# EAGLE schematic ESP-01 Miner (EAGLE 9.6.2)
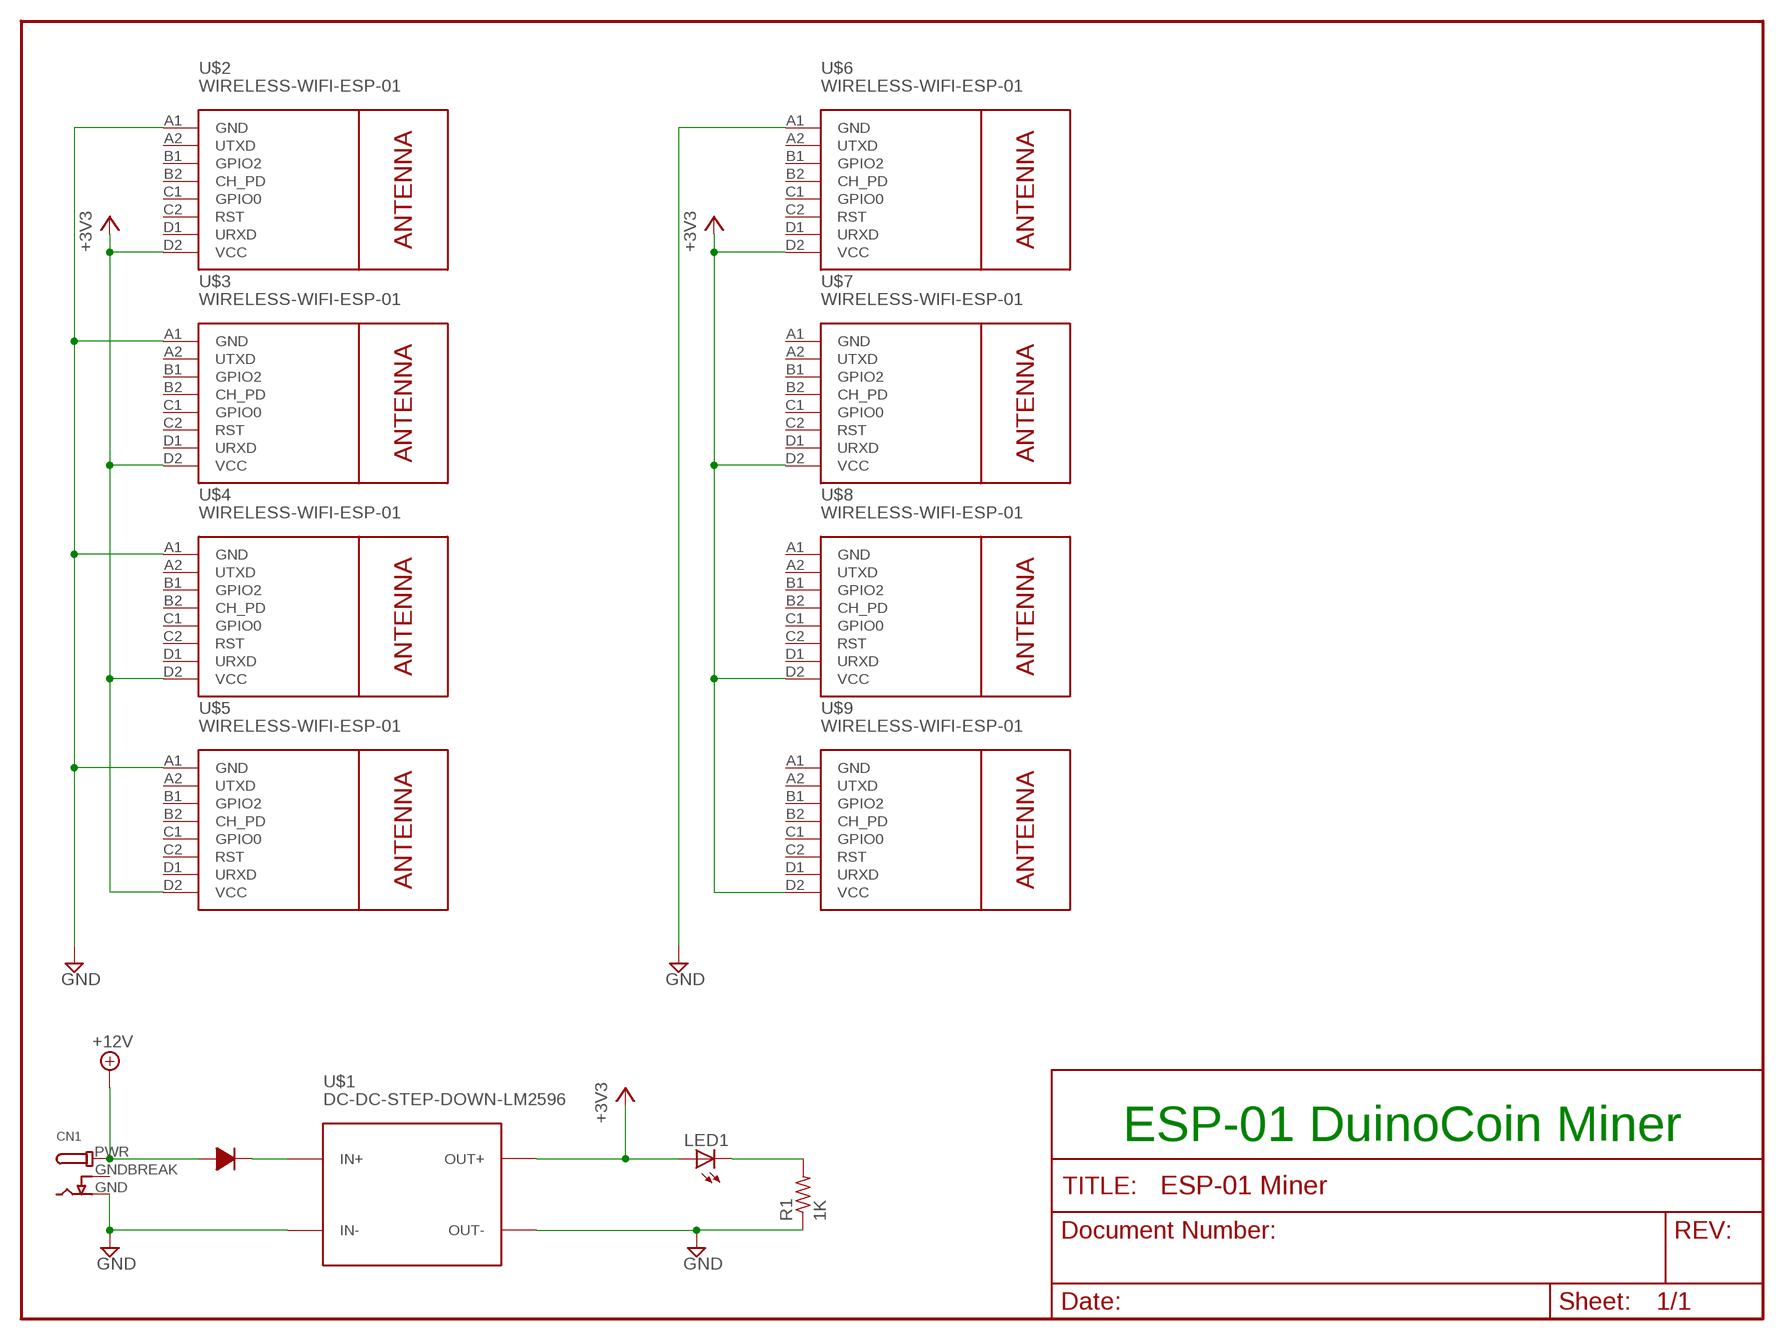
[diagram p0: schematic, sheet 1]

## Parts
CN1  DCBARRELPTH  [DCJACK_2MM_PTH]
LED1  LED3MM  [LED3MM]
R1  1K  R-US_0204/7  [0204/7]
U$1  DC-DC-STEP-DOWN-LM2596  [DC-DC-STEP-DOWN-LM2596]
U$2  WIRELESS-WIFI-ESP-01  [WIRELESS-WIFI-ESP-01]
U$3  WIRELESS-WIFI-ESP-01  [WIRELESS-WIFI-ESP-01]
U$4  WIRELESS-WIFI-ESP-01  [WIRELESS-WIFI-ESP-01]
U$5  WIRELESS-WIFI-ESP-01  [WIRELESS-WIFI-ESP-01]
U$6  WIRELESS-WIFI-ESP-01  [WIRELESS-WIFI-ESP-01]
U$7  WIRELESS-WIFI-ESP-01  [WIRELESS-WIFI-ESP-01]
U$8  WIRELESS-WIFI-ESP-01  [WIRELESS-WIFI-ESP-01]
U$9  WIRELESS-WIFI-ESP-01  [WIRELESS-WIFI-ESP-01]
U$10  1N4001  [DIODE-12.70]

## Nets
+3V3: LED1.A U$1.OUT+ U$2.D2(VCC) U$3.D2(VCC) U$4.D2(VCC) U$5.D2(VCC) U$6.D2(VCC) U$7.D2(VCC) U$8.D2(VCC) U$9.D2(VCC)
+12V: CN1.PWR U$10.P$1
GND: CN1.GND R1.1 U$1.IN- U$1.OUT- U$2.A1(GND) U$3.A1(GND) U$4.A1(GND) U$5.A1(GND) U$6.A1(GND)
N$1: U$1.IN+ U$10.P$2
N$3: LED1.K(C) R1.2
Unconnected: U$2.A2(UTXD) U$2.B1(GPIO2) U$2.B2(CH_PD) U$2.C1(GPIO0) U$2.C2(RST) U$2.D1(URXD) U$3.A2(UTXD) U$3.B1(GPIO2) U$3.B2(CH_PD) U$3.C1(GPIO0) U$3.C2(RST) U$3.D1(URXD) U$4.A2(UTXD) U$4.B1(GPIO2) U$4.B2(CH_PD) U$4.C1(GPIO0) U$4.C2(RST) U$4.D1(URXD) U$5.A2(UTXD) U$5.B1(GPIO2) U$5.B2(CH_PD) U$5.C1(GPIO0) U$5.C2(RST) U$5.D1(URXD) U$6.A2(UTXD) U$6.B1(GPIO2) U$6.B2(CH_PD) U$6.C1(GPIO0) U$6.C2(RST) U$6.D1(URXD) U$7.A2(UTXD) U$7.B1(GPIO2) U$7.B2(CH_PD) U$7.C1(GPIO0) U$7.C2(RST) U$7.D1(URXD) U$8.A2(UTXD) U$8.B1(GPIO2) U$8.B2(CH_PD) U$8.C1(GPIO0) U$8.C2(RST) U$8.D1(URXD) U$9.A2(UTXD) U$9.B1(GPIO2) U$9.B2(CH_PD) U$9.C1(GPIO0) U$9.C2(RST) U$9.D1(URXD)

## Notes on the sheet
- ESP-01 DuinoCoin Miner

## Power pins joined to a net without a drawn wire
GND: U$7.A1(GND) U$8.A1(GND) U$9.A1(GND)
GNDBREAK: CN1.GNDBREAK

## Library data of the parts
CN1 = microbuilder:DCBARREL: DC Barrel Jack DCJACK_1.3MM_PTH - Through Hole 1.3mm Jack (4UConnector: 05536) DCJACK_2MM_PTH - Through Hole 2.0/2.1 Jack (4UConnector: 05537) DCJACK_2MM_SMT - SMT 2.0/2.1mm Jack(4UConnector: 03267)
LED1 = led:LED: LED OSRAM: - CHIPLED LG R971, LG N971, LY N971, LG Q971, LY Q971, LO R971, LY R971 LH N974, LH R974 LS Q976, LO Q976, LY Q976 LO Q996 - Hyper CHIPLED LW Q18S LB Q993, LB Q99A, LB R99A - SideLED LS A670, LO A670, LY A670, LG A670, LP A670 LB A673, LV A673, LT A673, LW A673 LH A674 LY A675 LS A676, LA A676, LO A676, LY A676, LW A676 LS A679, LY A679, LG A679 - Hyper Micro SIDELED® LS Y876, LA Y876, LO Y876, LY Y876 LT Y87S - SmartLED LW L88C, LW L88S LB L89C, LB L89S, LG L890 LS L89K, LO L89K, LY L89K LS L896, LA L896, LO L896, LY L896 - TOPLED LS T670, LO T670, LY T670, LG T670, LP T670 LSG T670, LSP T670, LSY T670, LOP T670, LYG T670 LG T671, LOG T671, LSG T671 LB T673, LV T673, LT T673, LW T673 LH T674 LS T676, LA T676, LO T676, LY T676, LB T676, LH T676, LSB T676, LW T676 LB T67C, LV T67C, LT T67C, LS T67K, LO T67K, LY T67K, LW E67C LS E67B, LA E67B, LO E67B, LY E67B, LB E67C, LV E67C, LT E67C LW T67C LS T679, LY T679, LG T679 LS T770, LO T770, LY T770, LG T770, LP T770 LB T773, LV T773, LT T773, LW T773 LH T774 LS E675, LA E675, LY E675, LS T675 LS T776, LA T776, LO T776, LY T776, LB T776 LHGB T686 LT T68C, LB T68C - Hyper Mini TOPLED® LB M676 - Mini TOPLED Santana® LG M470 LS M47K, LO M47K, LY M47K Source: http://www.osram.convergy.de LUXEON: - LUMILED® LXK2-PW12-R00, LXK2-PW12-S00, LXK2-PW14-U00, LXK2-PW14-V00 LXK2-PM12-R00, LXK2-PM12-S00, LXK2-PM14-U00 LXK2-PE12-Q00, LXK2-PE12-R00, LXK2-PE12-S00, LXK2-PE14-T00, LXK2-PE14-U00 LXK2-PB12-K00, LXK2-PB12-L00, LXK2-PB12-M00, LXK2-PB14-N00, LXK2-PB14-P00, LXK2-PB14-Q00 LXK2-PR12-L00, LXK2-PR12-M00, LXK2-PR14-Q00, LXK2-PR14-R00 LXK2-PD12-Q00, LXK2-PD12-R00, LXK2-PD12-S00 LXK2-PH12-R00, LXK2-PH12-S00 LXK2-PL12-P00, LXK2-PL12-Q00, LXK2-PL12-R00 Source: www.luxeon.com KINGBRIGHT: KA-3528ASYC Source: www.kingbright.com
R1 = rcl:R-US_: RESISTOR, American symbol
U$1 = diy-modules:DC-DC-STEP-DOWN-LM2596: DC/DC Step-Down Regulator based on LM2596-ADJ chip LM2596 datasheet available here: http://www.ti.com/lit/ds/symlink/lm2596.pdf Click here to find device on ebay.com <http://www.ebay.com/sch/lm2596+power+regulator>
U$2-U$9 = diy-modules:WIRELESS-WIFI-ESP-01: Wireless Wi-Fi ESP-01 Module based on ESP8266 chip Click here to find device on ebay.com <http://www.ebay.com/sch/esp8266+esp+01+transceiver>
U$10 = Oles komponentbibliotek:1N4001: 1N4001 diode